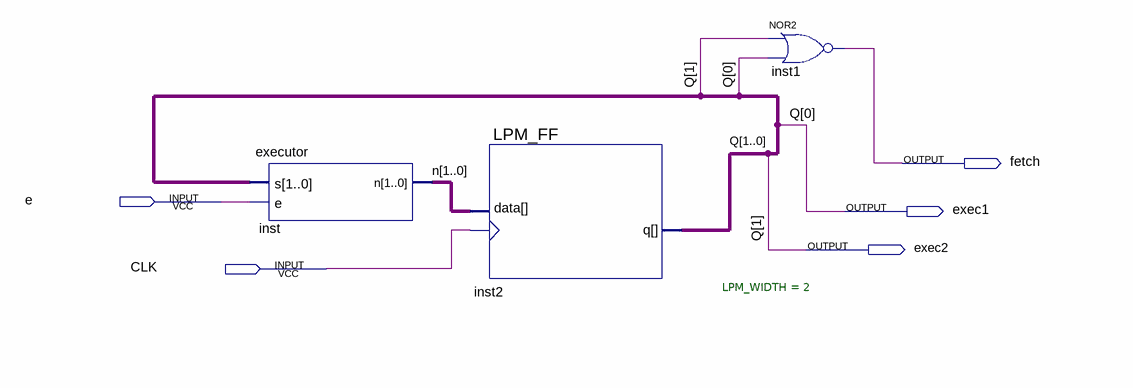
[diagram p0: schematic sheet]
// Quartus schematic StateMachine.bdf as structural Verilog: 3 symbols, 5 pins
module StateMachine (
  input  e,
  input  CLK,
  output fetch,
  output exec1,
  output exec2
);

  wire [1:0] n;

  executor inst (.s({exec2, exec1}), .e(e), .n(n));
  LPM_FF #(.LPM_WIDTH(2)) inst2 (.clock(CLK), .data(n), .q({exec2, exec1}));
  nor inst1 (fetch, exec2, exec1);

  // Other names for the same wires on the sheet: Q[1:0] = {exec2, exec1}
endmodule
